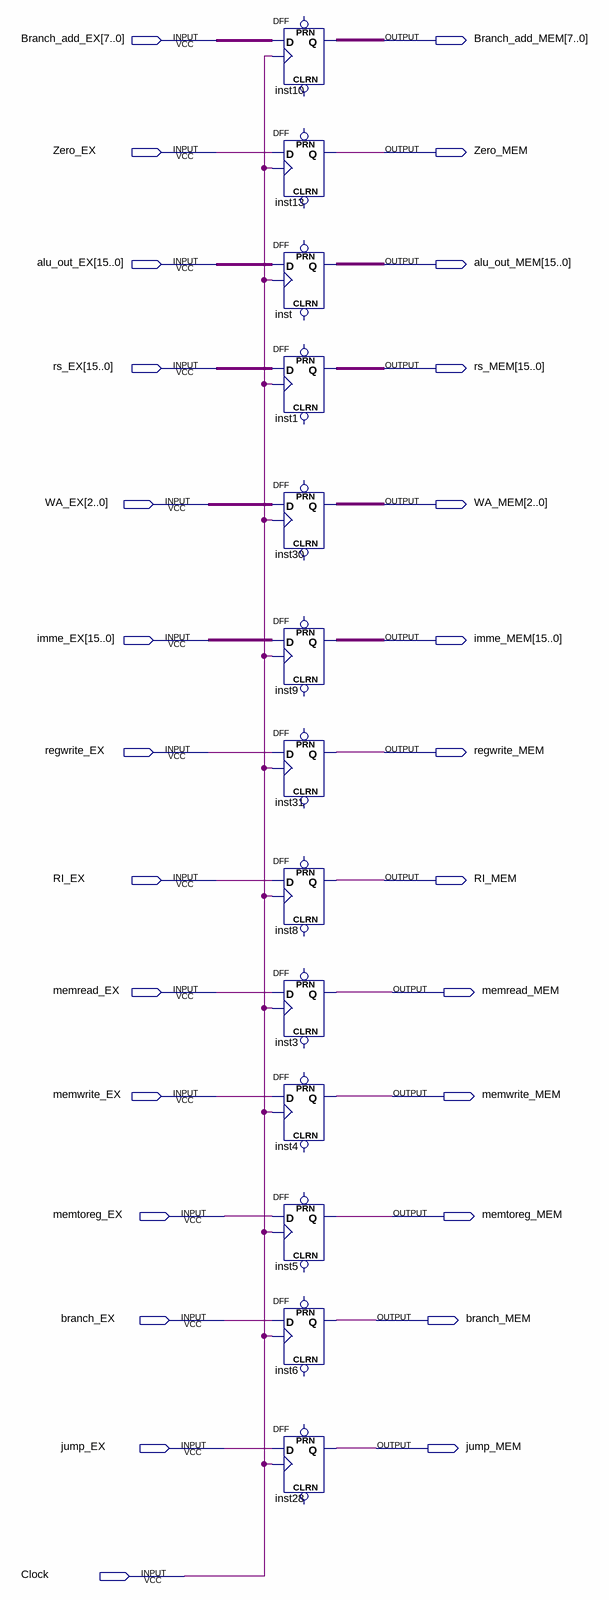
[diagram p0: schematic sheet]
// Quartus schematic EXMEM.bdf as structural Verilog: 13 symbols, 27 pins
module EXMEM (
  input  [7:0] Branch_add_EX,
  input  Zero_EX,
  input  [15:0] alu_out_EX,
  input  [15:0] rs_EX,
  input  [2:0] WA_EX,
  input  [15:0] imme_EX,
  input  regwrite_EX,
  input  RI_EX,
  input  memread_EX,
  input  memwrite_EX,
  input  memtoreg_EX,
  input  branch_EX,
  input  jump_EX,
  input  Clock,
  output [7:0] Branch_add_MEM,
  output Zero_MEM,
  output [15:0] alu_out_MEM,
  output [15:0] rs_MEM,
  output [2:0] WA_MEM,
  output [15:0] imme_MEM,
  output regwrite_MEM,
  output RI_MEM,
  output memread_MEM,
  output memwrite_MEM,
  output memtoreg_MEM,
  output branch_MEM,
  output jump_MEM
);

  DFF inst10[7:0] (.CLK(Clock), .D(Branch_add_EX), .Q(Branch_add_MEM));  // open: CLRN, PRN
  DFF inst13 (.CLK(Clock), .D(Zero_EX), .Q(Zero_MEM));  // open: CLRN, PRN
  DFF inst[15:0] (.CLK(Clock), .D(alu_out_EX), .Q(alu_out_MEM));  // open: CLRN, PRN
  DFF inst1[15:0] (.CLK(Clock), .D(rs_EX), .Q(rs_MEM));  // open: CLRN, PRN
  DFF inst30[2:0] (.CLK(Clock), .D(WA_EX), .Q(WA_MEM));  // open: CLRN, PRN
  DFF inst9[15:0] (.CLK(Clock), .D(imme_EX), .Q(imme_MEM));  // open: CLRN, PRN
  DFF inst31 (.CLK(Clock), .D(regwrite_EX), .Q(regwrite_MEM));  // open: CLRN, PRN
  DFF inst8 (.CLK(Clock), .D(RI_EX), .Q(RI_MEM));  // open: CLRN, PRN
  DFF inst3 (.CLK(Clock), .D(memread_EX), .Q(memread_MEM));  // open: CLRN, PRN
  DFF inst4 (.CLK(Clock), .D(memwrite_EX), .Q(memwrite_MEM));  // open: CLRN, PRN
  DFF inst5 (.CLK(Clock), .D(memtoreg_EX), .Q(memtoreg_MEM));  // open: CLRN, PRN
  DFF inst6 (.CLK(Clock), .D(branch_EX), .Q(branch_MEM));  // open: CLRN, PRN
  DFF inst28 (.CLK(Clock), .D(jump_EX), .Q(jump_MEM));  // open: CLRN, PRN
endmodule
